# Altium schematic sheet StreamDeck_Perifericos-V0.SchDoc: Perifericos - Stream Deck
size A4; Author: Guido Glorioso; CompanyName: Introducción al Diseño de Circuitos Impresos; Organization: UTN FRBA; Revision: 0; SheetNumber: 5; SheetTotal: 5
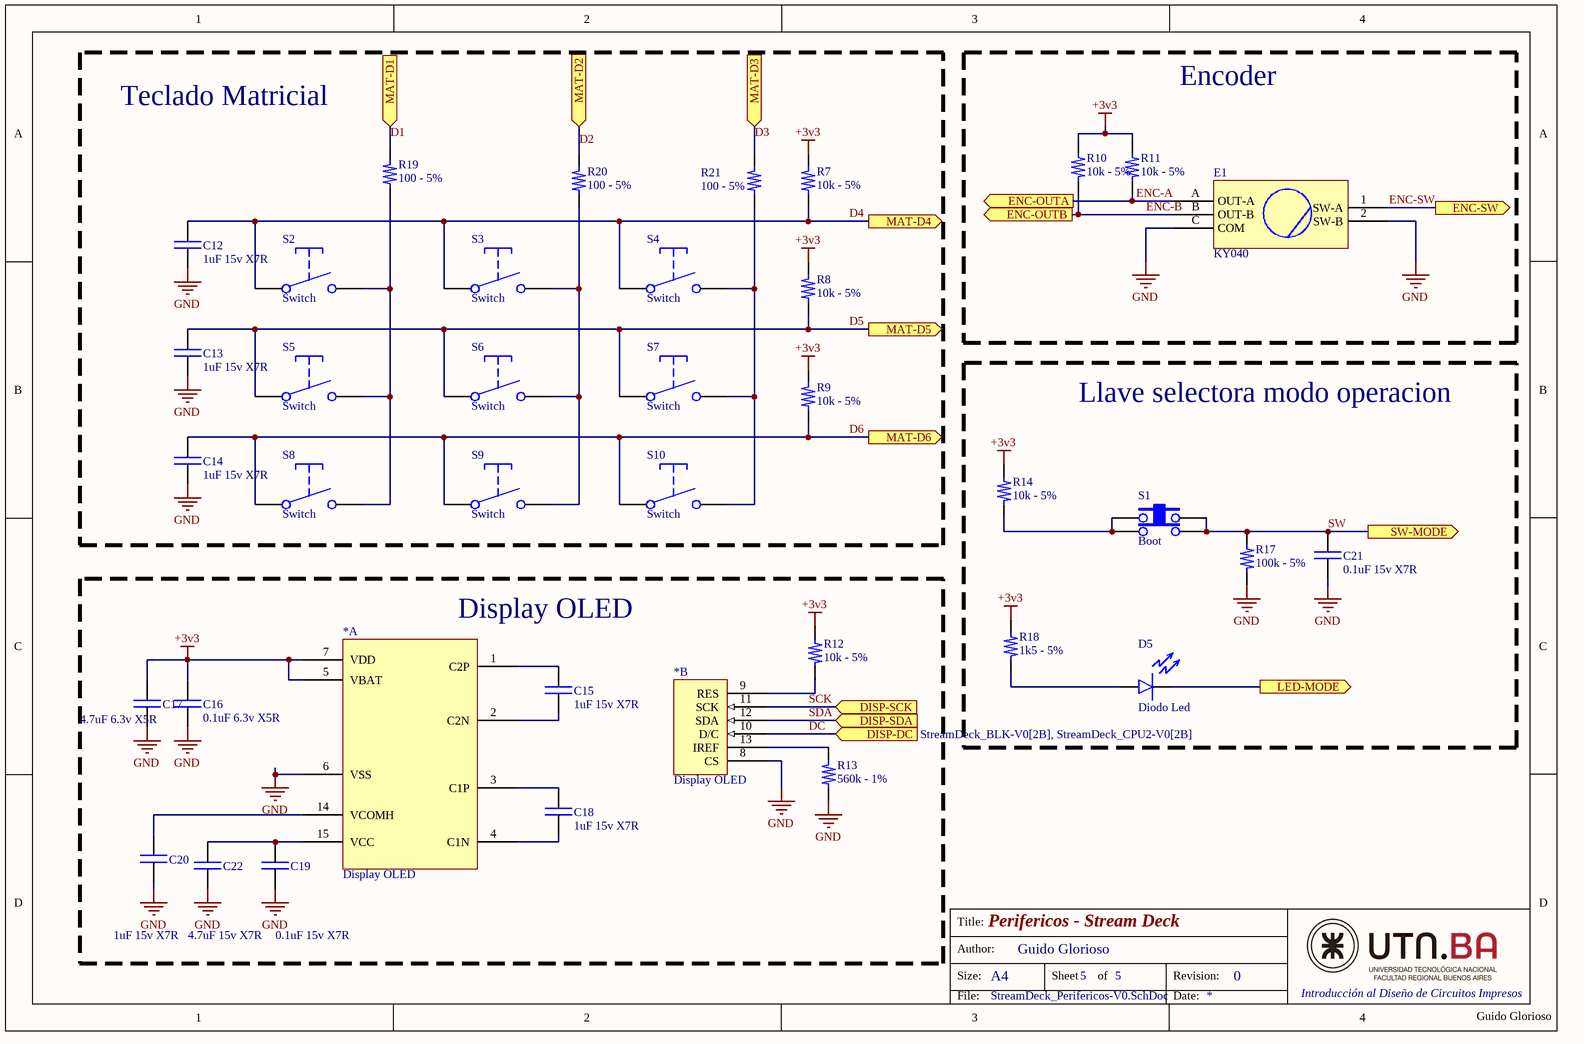
[diagram p0: StreamDeck_Perifericos-V0.SchDoc]

## Parts
(Parts that share a designator on the sheet are numbered #1, #2 ... from top to bottom, then left to right.)
*#1  Display OLED  [Display OLED -  0.91'']  (part B of 2)
*#2  Display OLED  [Display OLED -  0.91'']  (part A of 2)
C12  1uF 15v X7R  [C_0805]
C13  1uF 15v X7R  [C_0805]
C14  1uF 15v X7R  [C_0805]
C15  1uF 15v X7R  [C_0805]
C16  0.1uF 6.3v X5R  [C_0805]
C17  4.7uF 6.3v X5R  [C_0805]
C18  1uF 15v X7R  [C_0805]
C19  0.1uF 15v X7R  [C_0805]
C20  1uF 15v X7R  [C_0805]
C21  0.1uF 15v X7R  [C_0805]
C22  4.7uF 15v X7R  [C_0805]
D5  Diodo Led  [D_0805]
E1  KY040  [Encoder 5 pines]
R7  10k - 5%  [R_0805]
R8  10k - 5%  [R_0805]
R9  10k - 5%  [R_0805]
R10  10k - 5%  [R_0805]
R11  10k - 5%  [R_0805]
R12  10k - 5%  [R_0805]
R13  560k - 1%  [R_0805]
R14  10k - 5%  [R_0805]
R17  100k - 5%  [R_0805]
R18  1k5 - 5%  [R_0805]
R19  100 - 5%  [R_0805]
R20  100 - 5%  [R_0805]
R21  100 - 5%  [R_0805]
S1  Boot  [TACT Switch SMD]
S2  Switch  [Mechanical Switch]
S3  Switch  [Mechanical Switch]
S4  Switch  [Mechanical Switch]
S5  Switch  [Mechanical Switch]
S6  Switch  [Mechanical Switch]
S7  Switch  [Mechanical Switch]
S8  Switch  [Mechanical Switch]
S9  Switch  [Mechanical Switch]
S10  Switch  [Mechanical Switch]

## Blocks framed on the sheet
Teclado Matricial: C12-C14 R7-R9 R19-R21 S2-S10
Encoder: E1 R10 R11
Llave selectora modo operacion: C21 D5 R14 R17 R18 S1
Display OLED: *#1 *#2 C15-C20 C22 R12 R13

## Ports
DISP-DC (in, see StreamDeck_BLK-V0[2B], StreamDeck_CPU2-V0[2B]), DISP-SCK (in, see StreamDeck_BLK-V0[2B], StreamDeck_CPU2-V0[2B]), DISP-SDA (in, see StreamDeck_BLK-V0[2B], StreamDeck_CPU2-V0[2B]), ENC-OUTA (out, see StreamDeck_BLK-V0[2B], StreamDeck_CPU2-V0[4B]), ENC-OUTB (out, see StreamDeck_BLK-V0[2B], StreamDeck_CPU2-V0[4B]), ENC-SW (out, see StreamDeck_BLK-V0[2C], StreamDeck_CPU2-V0[4B]), LED-MODE (out, see StreamDeck_BLK-V0[2C], StreamDeck_CPU2-V0[4B]), MAT-D1 (in, see StreamDeck_BLK-V0[2B], StreamDeck_CPU2-V0[2B]), MAT-D2 (in, see StreamDeck_BLK-V0[2B], StreamDeck_CPU2-V0[2B]), MAT-D3 (in, see StreamDeck_BLK-V0[2B], StreamDeck_CPU2-V0[2B]), MAT-D4 (out, see StreamDeck_BLK-V0[2B], StreamDeck_CPU2-V0[4B]), MAT-D5 (out, see StreamDeck_BLK-V0[2B], StreamDeck_CPU2-V0[4B]), MAT-D6 (out, see StreamDeck_BLK-V0[2B], StreamDeck_CPU2-V0[4B]), SW-MODE (out, see StreamDeck_BLK-V0[2C], StreamDeck_CPU2-V0[4B])

## Nets
+3v3: *#2.5(VBAT) *#2.7(VDD) C16.1 C17.1 R7.2 R8.2 R9.2 R10.1 R11.1 R12.1 R14.1 R18.1
GND: *#1.8(CS) *#2.6(VSS) C12.2 C13.2 C14.2 C16.2 C17.2 C19.2 C20.2 C21.2 C22.2 E1.2(SW-B) E1.C(COM) R13.1 R17.2
D1: R19.2 ; port MAT-D1
D2: R20.2 ; port MAT-D2
D3: R21.2 ; port MAT-D3
D4: C12.1 R7.1 S2.1 S3.1 S4.1 ; port MAT-D4
D5: C13.1 R8.1 S5.1 S6.1 S7.1 ; port MAT-D5
D6: C14.1 R9.1 S8.1 S9.1 S10.1 ; port MAT-D6
DC: *#1.10(D/C) ; port DISP-DC
ENC-A: E1.A(OUT-A) R11.2 ; port ENC-OUTA
ENC-B: E1.B(OUT-B) R10.2 ; port ENC-OUTB
ENC-SW: E1.1(SW-A) ; port ENC-SW
LED-MODE: D5.2(catodo) ; port LED-MODE
SCK: *#1.11(SCK) ; port DISP-SCK
SDA: *#1.12(SDA) ; port DISP-SDA
SW: C21.1 R17.1 S1.3 S1.4 ; port SW-MODE
Net*#1_9: *#1.9(RES) R12.2
Net*#1_13: *#1.13(IREF) R13.2
Net*#2_1: *#2.1(C2P) C15.1
Net*#2_2: *#2.2(C2N) C15.2
Net*#2_3: *#2.3(C1P) C18.1
Net*#2_4: *#2.4(C1N) C18.2
Net*#2_14: *#2.14(VCOMH) C20.1
Net*#2_15: *#2.15(VCC) C19.1 C22.1
NetD5_1: D5.1(anodo) R18.2
NetR14_2: R14.2 S1.1 S1.2
NetR19_1: R19.1 S2.2 S5.2 S8.2
NetR20_1: R20.1 S3.2 S6.2 S9.2
NetR21_1: R21.1 S4.2 S7.2 S10.2

## Notes on the sheet
- Guido Glorioso
- Title:
- Size:
- Author:
- A4
- Sheet
- of
- Revision:
- File:
- Date:

## Library data of the parts
*#1 *#2 = Display OLED: Display OLED 0.91'' -  I2C - 128x32px - Controlador SSD1306
C12-C22 = Capacitor NP: Capacitor no polarizado
E1 = Encoder: Encoder KY040
R7-R14 R17-R21 = Resistor
S1 = Switch pulsador: Tact switch PCB
S2-S10 = Switch: Pulsador mecanico - Otemu/Cherry/Gateron